# Altium project ESP32-Realy-Switch-var-1.PrjPCB
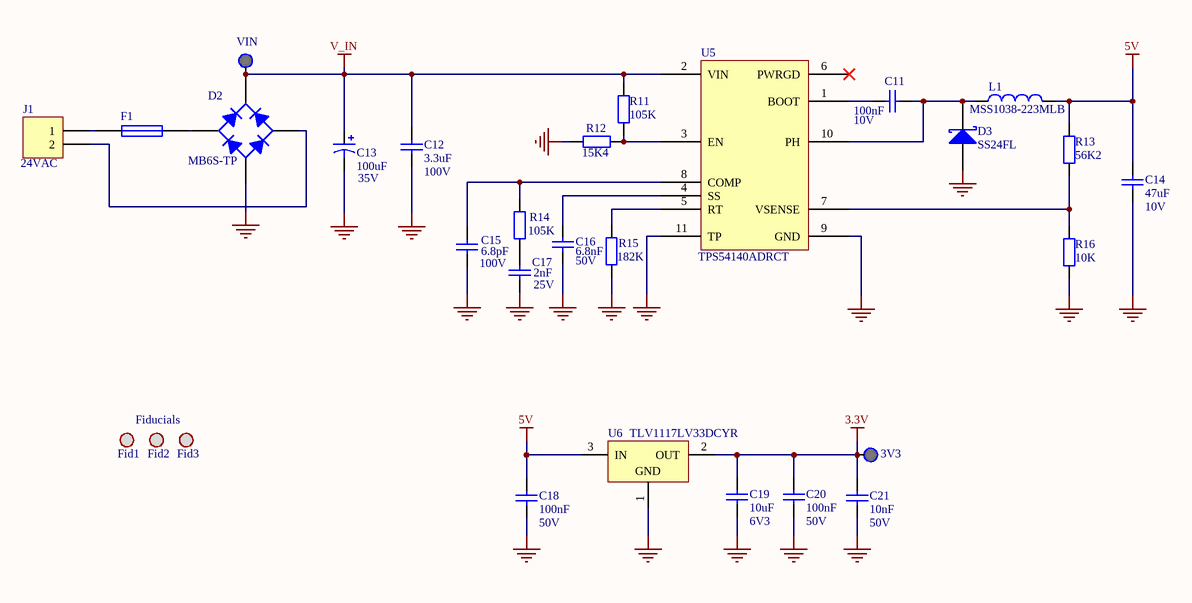
[diagram p0: Power Supply.SchDoc]
Engineer: M.GUENI; Title: CONNECTORS
5 sheets, 121 parts. Net scope: flat (ports and power ports of the same name join across sheets).
Board file: ESP32-Realy-Switch-var-1.PcbDoc
Sheets:
  Power Supply.SchDoc
  RF.SchDoc
  USB-PROG.SchDoc
  Relay.SchDoc
  CONNECTORS.SchDoc

## Sheet Power Supply.SchDoc: Power supply
size A4; Engineer: M.GUENI

### Parts
3V3  Test Point  [TP]  (value not drawn)  (no BOM)
C11  Value 1: 100nF  Value 2: 10V  [CAPC1608N]  (hidden comment: Capacitor)
C12  Value 1: 3.3uF  Value 2: 100V  [CAPC3216N]  (hidden comment: Capacitor)
C13  Value 1: 100uF  Value 2: 35V  [ECAP_SMD_6.3]  (hidden comment: Polarized Capacitor)
C14  Value 1: 47uF  Value 2: 10V  [CAPC2012N]  (hidden comment: Capacitor)
C15  Value 1: 6.8pF  Value 2: 100V  [CAPC1608N]  (hidden comment: Capacitor)
C16  Value 1: 6.8nF  Value 2: 50V  [CAPC1608N]  (hidden comment: Capacitor)
C17  Value 1: 2nF  Value 2: 25V  [CAPC2012N]  (hidden comment: Capacitor)
C18  Value 1: 100nF  Value 2: 50V  [CAPC1608N]  (hidden comment: Capacitor)
C19  Value 1: 10uF  Value 2: 6V3  [CAPC2012N]  (hidden comment: Capacitor)
C20  Value 1: 100nF  Value 2: 50V  [CAPC1608N]  (hidden comment: Capacitor)
C21  Value 1: 10nF  Value 2: 50V  [CAPC1608N]  (hidden comment: Capacitor)
D2  MB6S-TP  [MB6S]
D3  SS24FL  [SOD-123F]
F1  0452.500NRL  [Fuse_NANO2]  (value not drawn)
Fid1  Fiducial  [FIDUCIAL-1MM]  (value not drawn)
Fid2  Fiducial  [FIDUCIAL-1MM]  (value not drawn)
Fid3  Fiducial  [FIDUCIAL-1MM]  (value not drawn)
J1  24VAC  [CUI_TB007-508-02BE]
L1  MSS1038-223MLB  [MSS1038]
R11  Value 1: 105K  [RESC1608N]  (hidden comment: Resistor)
R12  Value 1: 15K4  [RESC1608N]  (hidden comment: Resistor)
R13  Value 1: 56K2  [RESC1608N]  (hidden comment: Resistor)
R14  Value 1: 105K  [RESC1608N]  (hidden comment: Resistor)
R15  Value 1: 182K  [RESC1608N]  (hidden comment: Resistor)
R16  Value 1: 10K  [RESC1608N]  (hidden comment: Resistor)
U5  TPS54140ADRCT  [VSON-10]
U6  TLV1117LV33DCYR  [SOT223]
VIN  Test Point  [TP]  (value not drawn)  (no BOM)

### Nets
3.3V: 3V3.1 C19.2 C20.2 C21.2 U6.2(OUT)
5V: C14.2 C18.2 L1.2 R13.2 U6.3(IN)
GND: C12.1 C13.2 C14.1 C15.1 C16.1 C17.1 C18.1 C19.1 C20.1 C21.1 D2.3(A) D3.1(A) R12.1 R15.1 R16.1 U5.9(GND) U5.11(TP) U6.1(GND)
V_IN: C12.2 C13.1 D2.1(K) R11.2 U5.2(VIN) VIN.1
NetC11_1: C11.1 U5.1(BOOT)
NetC11_2: C11.2 D3.2(K) L1.1 U5.10(PH)
NetC15_2: C15.2 R14.2 U5.8(COMP)
NetC16_2: C16.2 U5.4(SS)
NetC17_2: C17.2 R14.1
NetD2_2: D2.2(C) J1.2
NetD2_4: D2.4(C) F1.2
NetF1_1: F1.1 J1.1
NetR11_1: R11.1 R12.2 U5.3(EN)
NetR13_1: R13.1 R16.2 U5.7(VSENSE)
NetR15_2: R15.2 U5.5(RT)

Not connected (* = marked no-connect by the designer): U5 6(PWRGD)*

### Notes on the sheet
- Fiducials

### Library data of the parts
3V3 VIN = MIS-000000003: MAN: _; Part Number: MIS-000000003; MANREF: _; DES: _; Value 1: _; Value 2: _; TOL: _; FTP: _; SUP: _; SUPREF: _; NOTE: _
C11 = CAP-000000005: MAN: KEMET; MANREF: C0603X104K8RACTU; DES: C0603X104K8RACTU -  Condensateur céramique multicouche CMS, 0.1 µF, 10 V, 0603 [1608 Metric], ± 10%, X7R; TOL: 10%; FTP: 0603; SUP: Farnell; SUPREF: 2904937; NOTE: _; Part Number: CAP-000000005
C12 = CAP-000000009: MAN: TDK; MANREF: C3216X7S2A335M160AB; DES: C3216X7S2A335M160AB -  Condensateur céramique multicouche CMS, 3.3 µF, 100 V, 1206 [3216 Metric], ± 20%, X7S, C Series TDK; TOL: 20%; FTP: 1206; SUP: Farnell; SUPREF: 2526280; NOTE: _; Part Number: CAP-000000009
C13 = CAP-000000001: MAN: PANASONIC; MANREF: EEEFK1V101XP; DES: PANASONIC ELECTRONIC COMPONENTS  EEEFK1V101XP  CONDENSATEUR ELEC ALU 100UF 35V CMS; TOL: 20%; FTP: SMD Size D8; SUP: Farnell; SUPREF: 1850114; NOTE: _; Part Number: CAP-000000001
C14 = CAP-000000004: MAN: MURATA; MANREF: GRM21BR61A476ME15L; DES: GRM21BR61A476ME15L -  Condensateur céramique multicouche CMS, 47 µF, 10 V, 0805 [2012 Metric], ± 20%, X5R, GRM Series; TOL: 20%; FTP: 0805; SUP: Farnell; SUPREF: 2611939; NOTE: _; Part Number: CAP-000000004
C15 = CAP-000000008: MAN: AVX; MANREF: 06031U6R8BAT2A; DES: Multilayer Ceramic Capacitors MLCC - SMD/SMT 100V 6.8pF C0G 0603 .1pF Tol; TOL: _; FTP: 0603; SUP: Mouser; SUPREF: 581-06031U6R8BAT2A; Part Number: CAP-000000008; NOTE: _
C16 = CAP-000000006: MAN: KEMET; MANREF: C0603X682K5GECAUTO; DES: C0603X682K5GECAUTO -  Condensateur céramique multicouche CMS, ESD, AEC-Q200, 6800 pF, 50 V, 0603 [1608 Metric], ± 10%; TOL: 10%; FTP: 0603; SUP: Farnell; SUPREF: 2760504; NOTE: _; Part Number: CAP-000000006
C17 = CAP-000000007: MAN: KEMET; MANREF: C0805C202J3GACTU; DES: C0805C202J3GACTU -  Condensateur céramique multicouche CMS, 2000 pF, 25 V, 0805 [2012 Metric], ± 5%, C0G / NP0; TOL: 5%; FTP: 0805; SUP: Farnell; SUPREF: 2905236; NOTE: _; Part Number: CAP-000000007
C18 C20 = CAP-000000002: MAN: VISHAY; MANREF: VJ0603V104ZXAPW1BC; DES: VJ0603V104ZXAPW1BC -  Condensateur céramique multicouche CMS, 0.1 µF, 50 V, 0603 [1608 Metric], +80%, -20%, Y5V; TOL: +80% -20%; FTP: 0603; SUP: Farnell; SUPREF: 2896408; NOTE: _; Part Number: CAP-000000002
C19 = CAP-000000001: MAN: MULTICOMP; MANREF: MCTT21X106M6R3CT; DES: MCTT21X106M6R3CT -  Condensateur céramique multicouche CMS, 10 µF, 6.3 V, 0805 [2012 Metric], ± 20%, X5R, Série MCTT; TOL: 20%; FTP: 0805; SUP: Farnell; SUPREF: 1759476; NOTE: _; Part Number: CAP-000000001
C21 = CAP-000000003: MAN: MULTICOMP; MANREF: 06035C103JAT2A; DES: 06035C103JAT2A -  Condensateur céramique multicouche CMS, 10000 pF, 50 V, 0603 [1608 Metric], ± 5%, X7R; TOL: 5%; FTP: 0603; SUP: Farnell; SUPREF: 1833871; NOTE: _; Part Number: CAP-000000003
D2 = DIB-000000001: MAN: Micro Commercial Components (MCC); DES: Redresseurs en pont .5A 600V; Value 1: 0.5A; Value 2: 600V; TOL: _; FTP: MBS-1; SUP: Mouser; SUPREF: 833-MB6S-TP; Part Number: DIB-000000001; MANREF: MB6S-TP; NOTE: _
D3 = DIS-000000002: MAN: ON Semiconductor / Fairchild; DES: Schottky Diodes & Rectifiers 40V, 2A SCHOTTKY; Value 1: 2A; Value 2: 40V; TOL: _; FTP: SOD-123-2; SUP: Mouser; SUPREF: 512-SS24FL; Part Number: DIS-000000002; MANREF: SS24FL; NOTE: _
F1 = FUS-000000002: MAN: LITTELFUSE; DES: 0452.500NRL -  Fusible / Montage en surface, Série NANO2, 500 mA, 125 VAC, 32 VDC, Temporisé, CMS; Value 1: 500mA; Value 2: 32VDC; TOL: _; SUP: Farnell; SUPREF: 9922326; Part Number: FUS-000000002; MANREF: 0452.500NRL; FTP: _; NOTE: _
Fid1-Fid3 = MIS-000000004: MAN: _; Value 1: 1mm; Part Number: MIS-000000004; MANREF: _; DES: _; Value 2: _; TOL: _; FTP: _; SUP: _; SUPREF: _; NOTE: _
J1 = CON-000000001: MAN: CUI Devices; MANREF: TB007-508-02BE / 39910-0102; DES: Fixed Terminal Blocks Terminal block, screw type, 5.08 , horizontal, 2 poles, CUI Blue, slotted screw, PCB mount; Value 1: 2pts; Value 2: 5.08 mm; TOL: _; FTP: THT; SUP: Mouser; SUPREF: 490-TB007-508-02BE; Part Number: CON-000000001; NOTE: _
L1 = IND-000000001: MAN: Coilcraft; DES: Fixed Inductors MSS1038 SMT Shielded 22 uH 20 % 2.85 A; Value 1: 22uH; Value 2: 2.85A; TOL: 20%; FTP: _; SUP: Mouser; SUPREF: 994-MSS1038-223MLB; Part Number: IND-000000001; MANREF: MSS1038-223MLB; NOTE: _
R11 R14 = RES-000000003: MAN: PANASONIC ELECTRONIC COMPONENT; MANREF: ERJ3EKF1053V; DES: ERJ3EKF1053V -  Résistance à puce CMS, Couche épaisse, 105 kohm, Série ERJ3E, 75 V, Couche épaisse; Value 2: 0.1W; TOL: 1%; FTP: 0603; SUP: Farnell; SUPREF: 2059494; NOTE: _; Part Number: RES-000000003
R12 = RES-000000002: MAN: MULTICOMP; MANREF: MCMR06X1542FTL; DES: MCMR06X1542FTL -  Résistance à puce CMS, Céramique, 15.4 kohm, Série MCMR, 75 V, Couche épaisse, 0603 [1608 Metric]; Value 2: 0.1W; TOL: 1%; FTP: 0603; SUP: Farnell; SUPREF: 2073397; NOTE: _; Part Number: RES-000000002
R13 = RES-000000005: MAN: MULTICOMP; MANREF: MCWR06X5622FTL; DES: MCWR06X5622FTL -  Résistance à puce CMS, 56.2 kohm, MCWR06 Series, 75 V, Couche épaisse, 0603 [1608 Metric], 100 mW; Value 2: 0.1W; TOL: 1%; FTP: 0603; SUP: Farnell; SUPREF: 2694903; NOTE: _; Part Number: RES-000000005
R15 = RES-000000004: MAN: PANASONIC ELECTRONIC COMPONENTS; MANREF: ERJ3EKF1823V; DES: ERJ3EKF1823V -  Résistance à puce CMS, Couche épaisse, 182 kohm, Série ERJ3E, 75 V, Couche épaisse; Value 2: 0.1W; TOL: 1%; FTP: 0603; SUP: Farnell; SUPREF: 2059508; NOTE: _; Part Number: RES-000000004
R16 = RES-000000001: MAN: YAGEO; MANREF: RC0603FR-0710KL; DES: YAGEO (PHYCOMP)  RC0603FR-0710KL  RESISTANCE COUCHE EPAISSE 10K 0.1W 1%; Value 2: 0.1W; TOL: 1%; FTP: 0603; SUP: Farnell; SUPREF: 9238603; NOTE: _; Part Number: RES-000000001
U5 = ICP-000000006: MAN: Texas Instruments; DES: Switching Voltage Regulators 3.5-42Vin,1.5A SD Converter; Value 1: _; SUP: Mouser; SUPREF: 595-TPS54140ADRCT; Part Number: ICP-000000006; MANREF: TPS54140ADRCT; Value 2: _; TOL: _; FTP: VSON-10; NOTE: _
U6 = VRG-000000001: MAN: Texas Instrument; DES: TEXAS INSTRUMENTS  TLV1117LV33DCYR  LDO FIXE 3.3V 1A SOT-223-4; Value 1: 3.3V; Value 2: 1A; TOL: _; FTP: SOT-223; SUP: Mouser; SUPREF: 595-TLV1117LV33DCYR; Part Number: VRG-000000001; MANREF: TLV1117LV33DCYR; NOTE: _

## Sheet RF.SchDoc: RF
size A4; Engineer: M.GUENI; Revision: R0; SheetNumber: 2; SheetTotal: 5
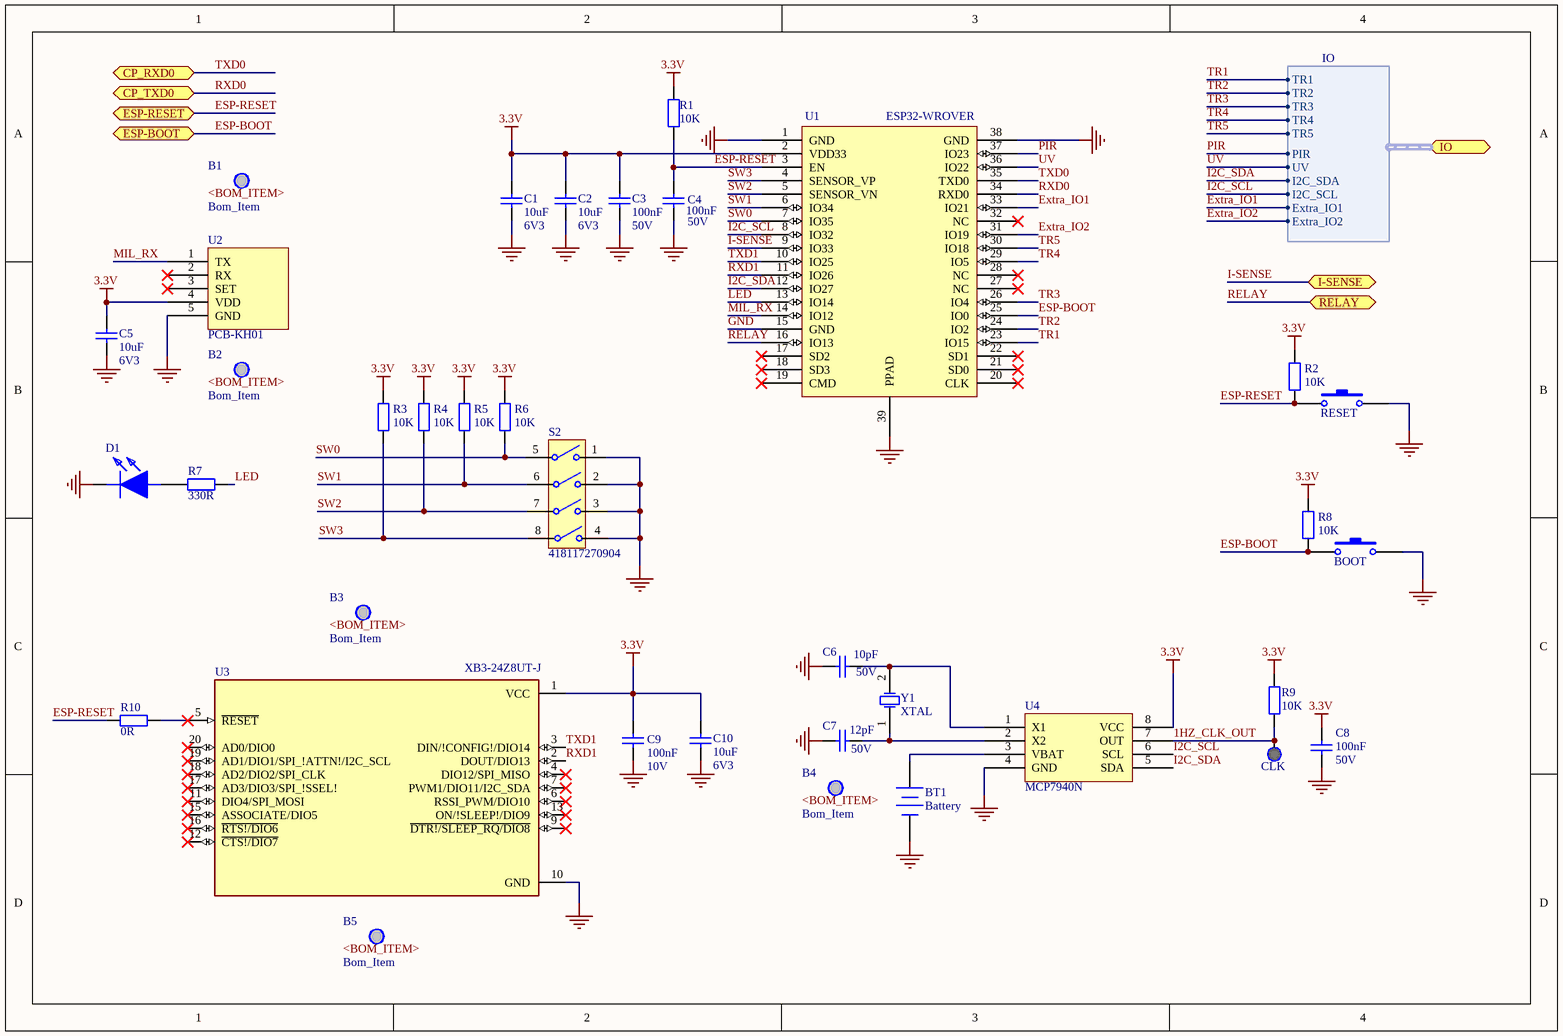
[diagram p1: RF.SchDoc]

### Parts
B1  Bom_Item  [_]  (mechanical)
B2  Bom_Item  [_]  (mechanical)
B3  Bom_Item  [_]  (mechanical)
B4  Bom_Item  [_]  (mechanical)
B5  Bom_Item  [_]  (mechanical)
BOOT  _  [FSM4]  (value not drawn)
BT1  Battery  [3050]
C1  Value 1: 10uF  Value 2: 6V3  [CAPC2012N]  (hidden comment: Capacitor)
C2  Value 1: 10uF  Value 2: 6V3  [CAPC2012N]  (hidden comment: Capacitor)
C3  Value 1: 100nF  Value 2: 50V  [CAPC1608N]  (hidden comment: Capacitor)
C4  Value 1: 100nF  Value 2: 50V  [CAPC1608N]  (hidden comment: Capacitor)
C5  Value 1: 10uF  Value 2: 6V3  [CAPC2012N]  (hidden comment: Capacitor)
C6  Value 1: 10pF  Value 2: 50V  [CAPC1608N]  (hidden comment: Capacitor)
C7  Value 1: 12pF  Value 2: 50V  [CAPC1608N]  (hidden comment: Capacitor)
C8  Value 1: 100nF  Value 2: 50V  [CAPC1608N]  (hidden comment: Capacitor)
C9  Value 1: 100nF  Value 2: 10V  [CAPC1608N]  (hidden comment: Capacitor)
C10  Value 1: 10uF  Value 2: 6V3  [CAPC2012N]  (hidden comment: Capacitor)
CLK  Test Point  [TP]  (value not drawn)  (no BOM)
D1  150080BS75000  [LEDC2012X80N1]  (value not drawn)
R1  Value 1: 10K  [RESC1608N]  (hidden comment: Resistor)
R2  Value 1: 10K  [RESC1608N]  (hidden comment: Resistor)
R3  Value 1: 10K  [RESC1608N]  (hidden comment: Resistor)
R4  Value 1: 10K  [RESC1608N]  (hidden comment: Resistor)
R5  Value 1: 10K  [RESC1608N]  (hidden comment: Resistor)
R6  Value 1: 10K  [RESC1608N]  (hidden comment: Resistor)
R7  Value 1: 330R  [RESC1608N]  (hidden comment: Resistor)
R8  Value 1: 10K  [RESC1608N]  (hidden comment: Resistor)
R9  Value 1: 10K  [RESC1608N]  (hidden comment: Resistor)
R10  Value 1: 0R  [RESC1608N]  (hidden comment: Resistor)
RESET  _  [FSM4]  (value not drawn)
S2  418117270904  [418117270904]
U1  ESP32-WROVER  [ESP32-WROVER]
U2  PCB-KH01  [MILIGHT_RF_MODULE]
U3  XB3-24Z8UT-J  [XB3-24Z8UT-J]
U4  MCP7940N  [DFN-8]
Y1  XTAL  [ECX-31B]

### Ports
CP_RXD0 (bidir), CP_TXD0 (bidir), ESP-BOOT (bidir), ESP-RESET (bidir), I-SENSE (bidir), IO (bidir, harness IO), RELAY (bidir)

### Harnesses
IO: TR1, TR2, TR3, TR4, TR5, PIR, UV, I2C_SDA, I2C_SCL, Extra_IO1, Extra_IO2

### Nets
3.3V: C1.1 C2.2 C3.2 C5.1 C8.2 C9.2 C10.2 R1.1 R2.2 R3.2 R4.2 R5.2 R6.2 R8.2 R9.2 U1.2(VDD33) U2.4(VDD) U3.1(VCC) U4.8(VCC)
GND: BOOT.2 BT1.2(-) C1.2 C2.1 C3.1 C4.1 C5.2 C6.1 C7.1 C8.1 C9.1 C10.1 D1.1(K) RESET.2 S2.1 S2.2 S2.3 S2.4 U1.1(GND) U1.15(GND) U1.38(GND) U1.39(PPAD) U2.5(GND) U3.10(GND) U4.4(GND)
1HZ_CLK_OUT: CLK.1 R9.1 U4.7(OUT)
ESP-BOOT: BOOT.1 R8.1 U1.25(IO0) ; port ESP-BOOT
ESP-RESET: C4.2 R1.2 R2.1 R10.2 RESET.1 U1.3(EN) ; port ESP-RESET
Extra_IO1: U1.33(IO21) ; port IO.Extra_IO1
Extra_IO2: U1.31(IO19) ; port IO.Extra_IO2
I2C_SCL: U1.8(IO32) U4.6(SCL) ; port IO.I2C_SCL
I2C_SDA: U1.12(IO27) U4.5(SDA) ; port IO.I2C_SDA
I-SENSE: U1.9(IO33) ; port I-SENSE
LED: R7.1 U1.13(IO14)
MIL_RX: U1.14(IO12) U2.1(TX)
PIR: U1.37(IO23) ; port IO.PIR
RELAY: U1.16(IO13) ; port RELAY
RXD0: U1.34(RXD0) ; port CP_TXD0
RXD1: U1.11(IO26) U3.2(DOUT/DIO13)
SW0: R6.1 S2.5 U1.7(IO35)
SW1: R5.1 S2.6 U1.6(IO34)
SW2: R4.1 S2.7 U1.5(SENSOR_VN)
SW3: R3.1 S2.8 U1.4(SENSOR_VP)
TR1: U1.23(IO15) ; port IO.TR1
TR2: U1.24(IO2) ; port IO.TR2
TR3: U1.26(IO4) ; port IO.TR3
TR4: U1.29(IO5) ; port IO.TR4
TR5: U1.30(IO18) ; port IO.TR5
TXD0: U1.35(TXD0) ; port CP_RXD0
TXD1: U1.10(IO25) U3.3(DIN/!CONFIG!/DIO14)
UV: U1.36(IO22) ; port IO.UV
NetBT1_1: BT1.1(+) U4.3(VBAT)
NetC6_2: C6.2 U4.1(X1) Y1.2(OSC2)
NetC7_2: C7.2 U4.2(X2) Y1.1(OSC1)
NetD1_2: D1.2(A) R7.2
NetR10_1: R10.1 U3.5(~{RESET})

Not connected (* = marked no-connect by the designer): U1 17(SD2)* 18(SD3)* 19(CMD)* 20(CLK)* 21(SD0)* 22(SD1)* 27(NC)* 28(NC)* 32(NC)*; U2 2(RX)* 3(SET)*; U3 4(DIO12/SPI_MISO)* 6(RSSI_PWM/DIO10)* 7(PWM1/DIO11/I2C_SDA)* 9(~{DTR!/SLEEP_RQ/DIO8})* 11(DIO4/SPI_MOSI)* 12(~{CTS!/DIO7})* 13(ON/!SLEEP!/DIO9)* 15(ASSOCIATE/DIO5)* 16(~{RTS!/DIO6})* 17(AD3/DIO3/SPI_!SSEL!)* 18(AD2/DIO2/SPI_CLK)* 19(AD1/DIO1/SPI_!ATTN!/I2C_SCL)* 20(AD0/DIO0)*

### Notes on the sheet
- Title:
- Micro Device Tunisie
- Size:
- Date:
- File:
- A4
- Engineer :
- Revision:
- Sheet
- of
- Cyber Parc  Hammam Sousse
- Avenue Charles De Gaulle
- 4011, Hammam-Sousse, Tunisie
- contact@mdtunisie.com
- (in symbol MIS-000000001) <BOM_ITEM>
- (in symbol MIS-000000019) <BOM_ITEM>
- (in symbol MIS-000000023) <BOM_ITEM>

### Library data of the parts
B1 B2 = MIS-000000019: MAN: TE CONNECTIVITY; MANREF: 215298-5; DES: Embase PCB, Carte-à-carte, 2.54 mm, 1 Rangée(s), 5 Contact(s), Montage traversant, AMPMODU Series; Value 1: 2.54 mm; SUP: Farnell; SUPREF: 2971171; Part Number: MIS-000000019; Value 2: _; TOL: _; FTP: _; NOTE: _
B3 B5 = MIS-000000001: MAN: TE CONNECTIVITY / Ajouter au comparateur / L'image a des fins d'illustration uniquement. Veuillez lire la description du produit. / TE CONNECTIVITY / Fabricant :; MANREF: 1-2314878-0; DES: 1-2314878-0 -  Connecteur carte-à-carte, 2 mm, 10 Contact(s), Embase, AMPMODU Series, Traversant, 1 Rangée(s); Value 1: 2mm; Value 2: 10pts; SUP: Farnell; SUPREF: 3289695; Part Number: MIS-000000001; TOL: _; FTP: _; NOTE: _
B4 = MIS-000000023: MAN: RENATA; MANREF: CR1025; DES: Batterie, Pile bouton, Cellule simple, 3 V, 1025, Lithium-dioxide de manganèse, 30 mAh; Value 1: 3V; Value 2: 30mAh; SUP: Farnell; SUPREF: 4199066; Part Number: MIS-000000023; TOL: _; FTP: _; NOTE: _
BOOT RESET = MIS-000000020: Part Number: MIS-000000020; MAN: _; MANREF: _; DES: _; Value 1: _; Value 2: _; TOL: _; FTP: _; SUP: _; SUPREF: _; NOTE: _
BT1 = MIS-000000022: Multicell Battery; MAN: Keystone Electronics; DES: Contacts de piles 10MM SM COIN CELL CLIP; Value 1: _; SUP: Mouser; SUPREF: 534-3050; Part Number: MIS-000000022; MANREF: 3050; Value 2: _; TOL: _; FTP: _; NOTE: _
C1 C2 C5 C10 = CAP-000000001: as C19 on sheet Power Supply; Part Number: CAP-000000001
C3 C4 C8 = CAP-000000002: as C18 on sheet Power Supply; Part Number: CAP-000000002
C6 = CAP-000000014: MAN: MULTICOMP; MANREF: MC0603N100J500CT; DES: MULTICOMP  MC0603N100J500CT  CONDENSATEUR MLCC C0G/NP0 10PF 50V 0603; TOL: 5%; FTP: 0603; SUP: Farnell; SUPREF: 2320799; NOTE: _; Part Number: CAP-000000014
C7 = CAP-000000015: MAN: MULTICOMP; MANREF: MC0603N120J500CT; DES: MULTICOMP 	MC0603N120J500CT  Condensateur céramique multicouche CMS, Série MC, 12 pF, ± 5%, C0G / NP0, 50 V, 0603 [1608 Metric]; TOL: 5%; FTP: 0603; SUP: Farnell; SUPREF: 1759054; NOTE: _; Part Number: CAP-000000015
C9 = CAP-000000005: as C11 on sheet Power Supply; Part Number: CAP-000000005
CLK = MIS-000000003: MAN: _; Part Number: MIS-000000003; MANREF: _; DES: _; Value 1: _; Value 2: _; TOL: _; FTP: _; SUP: _; SUPREF: _; NOTE: _
D1 = LED-000000002: MAN: Wurth Elektronik; DES: Standard LEDs - SMD WL-SMCW SMDMono TpVw Waterclr 0805 Blue; Value 1: 20 mA; Value 2: _; SUP: Mouser; SUPREF: 710-150080BS75000; Part Number: LED-000000002; MANREF: 150080BS75000; TOL: _; FTP: _; NOTE: _
R1-R6 R8 R9 = RES-000000001: as R16 on sheet Power Supply; Part Number: RES-000000001
R7 = RES-000000080: MAN: MULTICOMP; MANREF: MCMR06X331 JTL; DES: MCMR06X331 JTL -  Résistance à puce CMS, Céramique, 330 ohm, Série MCMR, 75 V, Couche épaisse, 0603 [1608 Metric]; Value 2: 0.1W; TOL: 1%; FTP: 0603; SUP: Farnell; SUPREF: 2073475; NOTE: _; Part Number: RES-000000080
R10 = RES-000000103: MAN: Vishay / Beyschlag; MANREF: MCT06030Z0000ZP500; DES: Thin Film Resistors - SMD Zero ohm Jumper; Value 2: 0.125W; TOL: _; FTP: 0603; SUP: Mouser; SUPREF: 594-MCT06030Z0000ZP5; Part Number: RES-000000103; NOTE: _
S2 = SWC-000000004: MAN: Wurth Elektronik; DES: Commutateurs DIL/Commutateurs SIL WS-DITV DIP 4p THT 2.54mm Hrztl Box; Value 1: _; SUP: Mouser; SUPREF: 710-418117270904; NOTE: In Stock; Part Number: SWC-000000004; MANREF: 418117270904; Value 2: _; TOL: _; FTP: _
U1 = RFC-000000001: MAN: Espressif Systems; DES: Modules WiFi / 802.11 SMD Module, ESP32-D0WDQ6, 32Mbits PSRAM, 32Mbits SPI flash, PCB Antenna; Value 1: _; SUP: ASTONE TECHNOLOGY; Part Number: RFC-000000001; MANREF: ESP32-WROVER; Value 2: _; TOL: _; FTP: _; SUPREF: ESP32-WROVER; NOTE: _
U2 = RFC-000000003: MAN: Milight; DES: RF Module; Value 1: _; SUP: Deliled; Part Number: RFC-000000003; MANREF: PCB-KH01; Value 2: _; TOL: _; FTP: _; SUPREF: PCB-KH01; NOTE: _
U3 = RFC-000000002: MAN: DIGI; DES: Zigbee Modules (802.15.4) XBee3,2.4 Ghz ZB 3.0, U.FL Ant, TH MT; Value 1: _; SUP: Mouser; SUPREF: 888-XB3-24Z8UT; Part Number: RFC-000000002; MANREF: XB3-24Z8UT-J; Value 2: _; TOL: _; FTP: _; NOTE: _
U4 = GIC-000000001: 64 x 8, Serial, I2C Real-Time Clock; MAN: Microchip Technology; MANREF: MCP7940NT-I/MNY; DES: Horloge en temps réel I2C GP RTCC 64B SRAM; Value 1: _; SUP: Mouser; SUPREF: 579-MCP7940NT-I/MNY; Part Number: GIC-000000001; Value 2: _; TOL: _; FTP: DFN-8; NOTE: _
Y1 = MIS-000000021: Crystal Oscillator; MAN: ECS; MANREF: ECS-.327-6-34B-TR; DES: Quartz 32.768kHz 6pF 20ppm -40C +85C; Value 1: 32.768KHZ; Value 2: 6pF; TOL: _; SUP: Mouser; SUPREF: 520-.327-6-34BT; Part Number: MIS-000000021; FTP: _; NOTE: _

## Sheet USB-PROG.SchDoc: USB-PROGRAMMER
size A4; Engineer: M.GUENI; Revision: R0; SheetNumber: 3; SheetTotal: 5
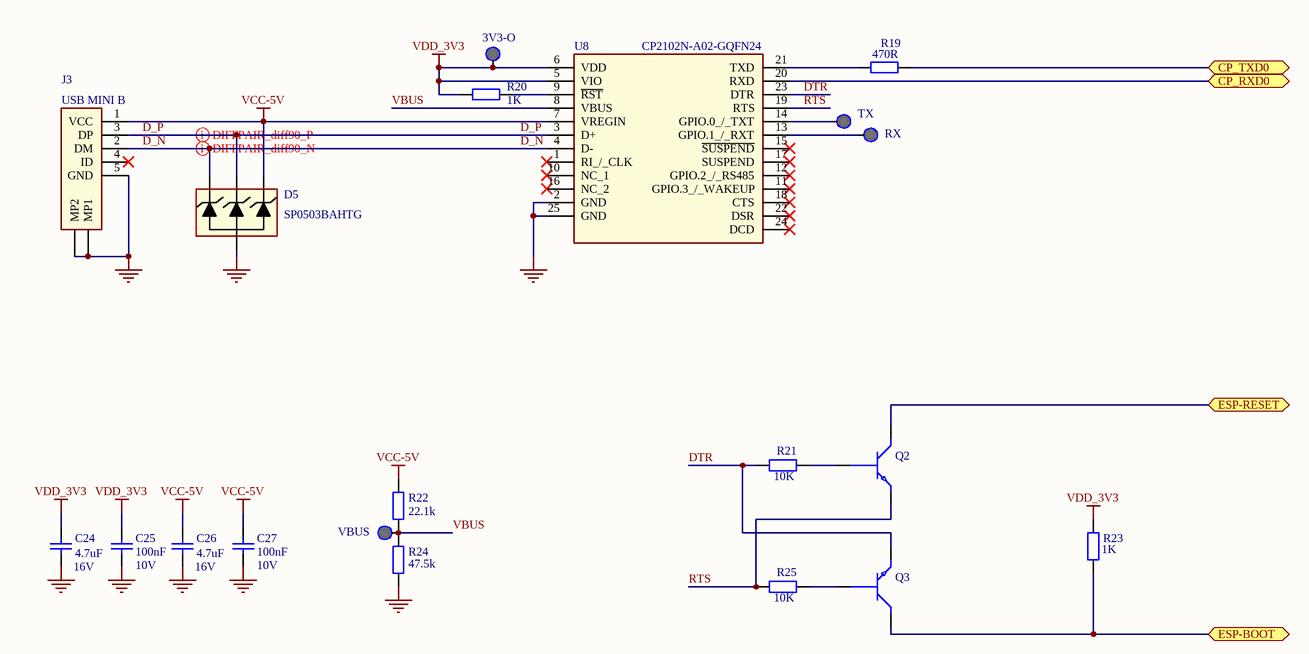
[diagram p2: USB-PROG.SchDoc]

### Parts
3V3-O  Test Point  [TP]  (value not drawn)  (no BOM)
C24  Value 1: 4.7uF  Value 2: 16V  [CAPC1608N]  (hidden comment: Capacitor)
C25  Value 1: 100nF  Value 2: 10V  [CAPC1608N]  (hidden comment: Capacitor)
C26  Value 1: 4.7uF  Value 2: 16V  [CAPC1608N]  (hidden comment: Capacitor)
C27  Value 1: 100nF  Value 2: 10V  [CAPC1608N]  (hidden comment: Capacitor)
D5  SP0503BAHTG  [SOT192P237X122-4N]
J3  USB MINI B  [502237-0517]
Q2  MMSS8050-H-TP  [SOT95P245X112-3N]  (value not drawn)
Q3  MMSS8050-H-TP  [SOT95P245X112-3N]  (value not drawn)
R19  Value 1: 470R  [RESC1608N]  (hidden comment: Resistor)
R20  Value 1: 1K  [RESC1608N]  (hidden comment: Resistor)
R21  Value 1: 10K  [RESC1608N]  (hidden comment: Resistor)
R22  Value 1: 22.1k  [RESC1608N]  (hidden comment: Resistor)
R23  Value 1: 1K  [RESC1608N]  (hidden comment: Resistor)
R24  Value 1: 47.5k  [RESC1608N]  (hidden comment: Resistor)
R25  Value 1: 10K  [RESC1608N]  (hidden comment: Resistor)
RX  Test Point  [TP]  (value not drawn)  (no BOM)
TX  Test Point  [TP]  (value not drawn)  (no BOM)
U8  CP2102N-A02-GQFN24  [QFN50P400X400X80-25N-D]
VBUS  Test Point  [TP]  (value not drawn)  (no BOM)

### Ports
CP_RXD0 (bidir), CP_TXD0 (bidir), ESP-BOOT (bidir), ESP-RESET (bidir)

### Nets
GND: C24.1 C25.1 C26.1 C27.1 D5.1 J3.5(GND) J3.MP1 J3.MP2 R24.1 U8.2(GND) U8.25(GND)
VCC-5V: C26.2 C27.2 D5.4 J3.1(VCC) R22.2 U8.7(VREGIN)
VDD_3V3: 3V3-O.1 C24.2 C25.2 R20.1 R23.2 U8.5(VIO) U8.6(VDD)
D_N: D5.2 J3.2(DM) U8.4(D-)
D_P: D5.3 J3.3(DP) U8.3(D+)
DTR: Q3.2(E) R21.1 U8.23(DTR)
ESP-BOOT: Q3.3(C) R23.1 ; port ESP-BOOT
ESP-RESET: Q2.3(C) ; port ESP-RESET
RTS: Q2.2(E) R25.1 U8.19(RTS)
RXD0: R19.2 ; port CP_TXD0
TXD0: U8.20(RXD) ; port CP_RXD0
VBUS: R22.1 R24.2 U8.8(VBUS) VBUS.1
NetQ2_1: Q2.1(B) R21.2
NetQ3_1: Q3.1(B) R25.2
NetR19_1: R19.1 U8.21(TXD)
NetR20_2: R20.2 U8.9(~{RST})
NetRX_1: RX.1 U8.13(GPIO.1_/_RXT)
NetTX_1: TX.1 U8.14(GPIO.0_/_TXT)

Not connected (* = marked no-connect by the designer): J3 4(ID)*; U8 1(RI_/_CLK)* 10(NC_1)* 11(GPIO.3_/_WAKEUP)* 12(GPIO.2_/_RS485)* 15(~{SUSPEND})* 16(NC_2)* 17(SUSPEND)* 18(CTS)* 22(DSR)* 24(DCD)*

### Layout directives
differential pair; differential pair class Diff90: D_N, D_P

### Notes on the sheet
- Title:
- Micro Device Tunisie
- Size:
- Date:
- File:
- A4
- Engineer :
- Revision:
- Sheet
- of
- Cyber Parc  Hammam Sousse
- Avenue Charles De Gaulle
- 4011, Hammam-Sousse, Tunisie
- contact@mdtunisie.com

### Library data of the parts
3V3-O RX TX VBUS = MIS-000000003: MAN: _; Part Number: MIS-000000003; MANREF: _; DES: _; Value 1: _; Value 2: _; TOL: _; FTP: _; SUP: _; SUPREF: _; NOTE: _
C24 C26 = CAP-000000047: MAN: Murata Electronics; MANREF: GRM188C71C475KE21D; DES: Multilayer Ceramic Capacitors MLCC - SMD/SMT 4.7UF 16V 10% 0603; TOL: 10%; FTP: 0603; SUP: Mouser; SUPREF: 81-GRM188C71C475KE1D; NOTE: _; Part Number: CAP-000000047
C25 C27 = CAP-000000005: as C11 on sheet Power Supply; Part Number: CAP-000000005
D5 = TVS-000000002: MAN: Littelfuse; DES: ESD Suppressors / TVS Diodes TVS AVAL DIODE SMT; Value 1: 5.5 V; Value 2: 30 pF; TOL: _; FTP: SOT-143; SUP: Mouser; SUPREF: 576-SP0503BAHTG; Part Number: TVS-000000002; MANREF: SP0503BAHTG; NOTE: _
J3 = CON-000000005: MAN: Molex; DES: USB Connectors USB Mini-B Rec Hsg Assy S/T 5Ckt; Value 1: _; FTP: THT; SUP: Mouser; SUPREF: 538-502237-0517; Part Number: CON-000000005; MANREF: 502237-0517; Value 2: _; TOL: _; NOTE: _
Q2 Q3 = TRP-000000003: MAN: Micro Commercial Components (MCC); DES: Bipolar Transistors - BJT 625mW, 25V, 1500mA; Value 1: 1.5 A; Value 2: 5 V; SUP: Mouser; SUPREF: 833-MMSS8050-H-TP; NOTE: _; Part Number: TRP-000000003; MANREF: MMSS8050-H-TP
R19 = RES-000000016: MAN: YAGEO; MANREF: RC0603FR-10470RL; DES: Thick Film Resistors - SMD 470 OHM 1%; Value 2: 0.1W; TOL: 1%; FTP: 0603; SUP: Mouser; SUPREF: 603-RC0603FR-10470RL; NOTE: _; Part Number: RES-000000016
R20 R23 = RES-000000006: MAN: TE Connectivity / Neohm; MANREF: CPF0603F1K0C1; DES: Thin Film Resistors - SMD 1KOhm .063W 50PPM; Value 2: 0.625W; TOL: 1%; FTP: 0603; SUP: Mouser; SUPREF: 279-CPF0603F1K0C1; NOTE: _; Part Number: RES-000000006
R21 R25 = RES-000000001: as R16 on sheet Power Supply; Part Number: RES-000000001
R22 = RES-000000017: MAN: Panasonic; MANREF: ERA-3AED2212V; DES: Thin Film Resistors - SMD 0603 22.1Kohms 25ppm 0.5% AEC-Q200; Value 2: 0.1W; TOL: 0.5%; FTP: 0603; SUP: Mouser; SUPREF: 667-ERA-3AED2212V; NOTE: _; Part Number: RES-000000017
R24 = RES-000000018: MAN: Vishay / Dale; MANREF: CRCW060347K5FKEA; DES: Thick Film Resistors - SMD 1/10watt 47.5Kohms 1%; Value 2: 0.1W; TOL: 1%; FTP: 0603; SUP: Mouser; SUPREF: 71-CRCW0603-47.5K-E3; NOTE: _; Part Number: RES-000000018
U8 = MIS-000000025: MAN: SILICON LABS; DES: Circuit intégré d'interface USB USBXpress - USB to UART Bridge QFN24; Value 1: _; FTP: QFN-24; SUP: Mouser; SUPREF: 634-CP2102NA02GQFN24; Part Number: MIS-000000025; MANREF: CP2102N-A02-GQFN24; Value 2: _; TOL: _; NOTE: _

## Sheet Relay.SchDoc: CONNECTORS
size A4
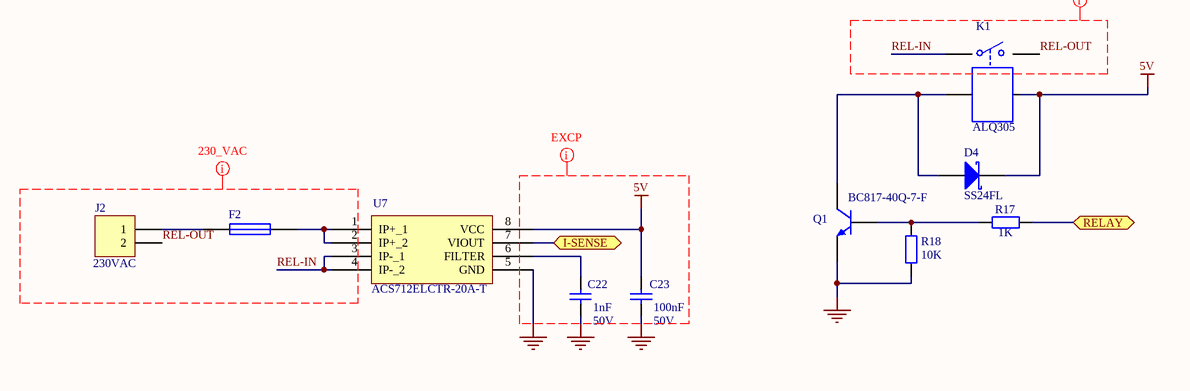
[diagram p3: Relay.SchDoc]

### Parts
C22  Value 1: 1nF  Value 2: 50V  [CAPC1608N]  (hidden comment: Capacitor)
C23  Value 1: 100nF  Value 2: 50V  [CAPC1608N]  (hidden comment: Capacitor)
D4  SS24FL  [SOD-123F]
F2  0031.8001  [SCHURTER_0031.8201]  (value not drawn)
J2  230VAC  [CUI_TB007-508-02BE]
K1  ALQ305  [ALQ305]
Q1  BC817-40Q-7-F  [SOT23-3N]
R17  Value 1: 1K  [RESC1608N]  (hidden comment: Resistor)
R18  Value 1: 10K  [RESC1608N]  (hidden comment: Resistor)
U7  ACS712ELCTR-20A-T  [SOIC127P600X175-8N]

### Ports
I-SENSE (bidir), RELAY (bidir)

### Nets
5V: C23.2 D4.2(K) K1.1(COIL_1) U7.8(VCC)
GND: C22.1 C23.1 Q1.3(E) R18.1 U7.5(GND)
I-SENSE: U7.7(VIOUT) ; port I-SENSE
REL-IN: K1.3(COM) U7.3(IP-_1) U7.4(IP-_2)
REL-OUT: J2.2 K1.2(NO)
RELAY: R17.2 ; port RELAY
NetC22_2: C22.2 U7.6(FILTER)
NetD4_1: D4.1(A) K1.4(COIL_2) Q1.2(C)
NetF2_1: F2.1 J2.1
NetF2_2: F2.2 U7.1(IP+_1) U7.2(IP+_2)
NetQ1_1: Q1.1(B) R17.1 R18.2

### Layout directives
net class 230_VAC: REL-IN, REL-OUT
net class EXCP: 5V, GND

### Library data of the parts
C22 = CAP-000000010: MAN: MULTICOMP; MANREF: MC0603B102K500CT; DES: MC0603B102K500CT -  Condensateur céramique multicouche CMS, 0603 [1608 Metric], 1000 pF, 50 V, ± 10%, X7R, Série MC; TOL: 10%; FTP: 0603; SUP: Farnell; SUPREF: 1759088; NOTE: _; Part Number: CAP-000000010
C23 = CAP-000000002: as C18 on sheet Power Supply; Part Number: CAP-000000002
D4 = DIS-000000002: as D3 on sheet Power Supply; Part Number: DIS-000000002; MANREF: SS24FL; NOTE: _
F2 = FUS-000000001: MAN: Schurter; DES: Fuse Holder OG FUSEHOLDER 5X20; Value 1: 10A; Value 2: 600V; TOL: _; SUP: Mouser; SUPREF: 693-0031.8001; Part Number: FUS-000000001; MANREF: 0031.8001; FTP: _; NOTE: _
J2 = CON-000000001: as J1 on sheet Power Supply; Part Number: CON-000000001; NOTE: _
K1 = SWC-000000003: MAN: Panasonic Industrial Devices; DES: General Purpose Relays LQ Relay; Value 1: 10 A; Value 2: 5 VDC; SUP: Mouser; SUPREF: 769-ALQ305; NOTE: _; Part Number: SWC-000000003; MANREF: ALQ305
Q1 = TRP-000000001: MAN: Diodes Incorporated; DES: Bipolar Transistors - BJT SS Low Sat Transistor; Value 1: 0.5A; Value 2: 45V; TOL: _; FTP: SOT-23; SUP: Mouser; SUPREF: 621-BC817-40Q-7-F; Part Number: TRP-000000001; MANREF: BC817-40Q-7-F; NOTE: _
R17 = RES-000000006: as R20 on sheet USB-PROG; Part Number: RES-000000006
R18 = RES-000000001: as R16 on sheet Power Supply; Part Number: RES-000000001
U7 = SEN-000000001: MAN: ALLEGRO MICROSYSTEMS; DES: ACS712ELCTR-20A-T -  Capteur de courant linéaire, Effet Hall, +/- 20A, SOIC-8; Value 1: 20A; Value 2: 5V; TOL: _; FTP: SOIC-8; SUP: Farnell; SUPREF: 1329624RL; Part Number: SEN-000000001; MANREF: ACS712ELCTR-20A-T; NOTE: _

## Sheet CONNECTORS.SchDoc: CONNECTORS
size A4; Engineer: M.GUENI; Revision: R0; SheetNumber: 5; SheetTotal: 5
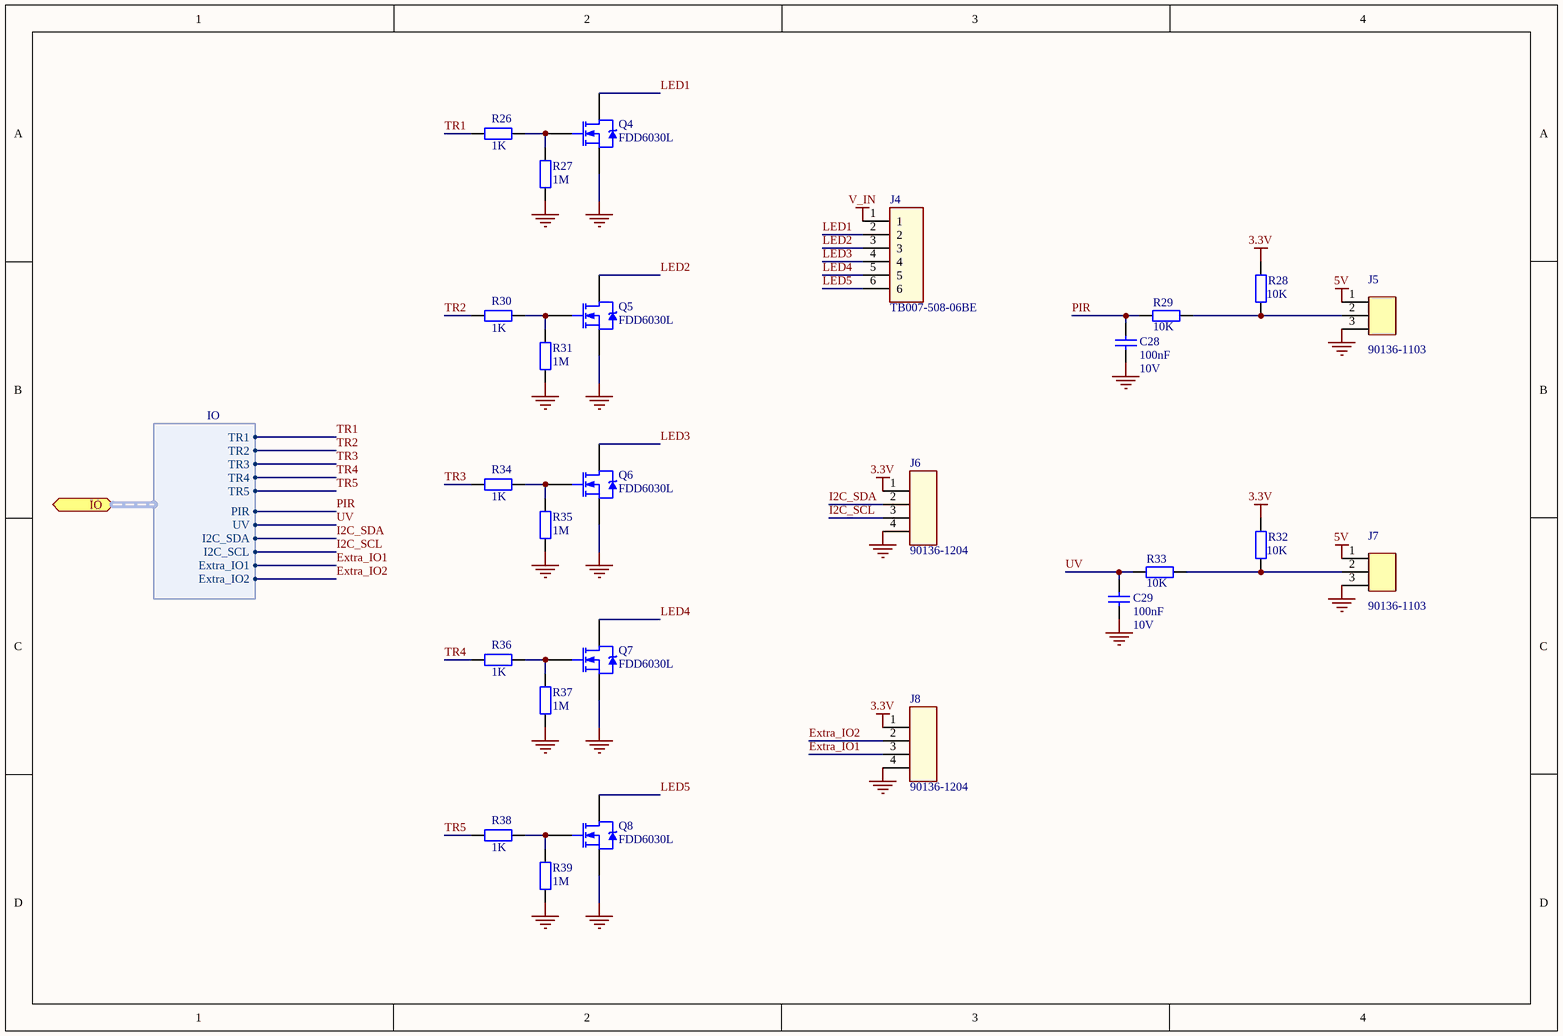
[diagram p4: CONNECTORS.SchDoc]

### Parts
C28  Value 1: 100nF  Value 2: 10V  [CAPC1608N]  (hidden comment: Capacitor)
C29  Value 1: 100nF  Value 2: 10V  [CAPC1608N]  (hidden comment: Capacitor)
J4  TB007-508-06BE  [HDR1X6]
J5  90136-1103  [HDR1X3]
J6  90136-1204  [HDR1X4]
J7  90136-1103  [HDR1X3]
J8  90136-1204  [HDR1X4]
Q4  FDD6030L  [TO-252-3]
Q5  FDD6030L  [TO-252-3]
Q6  FDD6030L  [TO-252-3]
Q7  FDD6030L  [TO-252-3]
Q8  FDD6030L  [TO-252-3]
R26  Value 1: 1K  [RESC1608N]  (hidden comment: Resistor)
R27  Value 1: 1M  [RESC1608N]  (hidden comment: Resistor)
R28  Value 1: 10K  [RESC1608N]  (hidden comment: Resistor)
R29  Value 1: 10K  [RESC1608N]  (hidden comment: Resistor)
R30  Value 1: 1K  [RESC1608N]  (hidden comment: Resistor)
R31  Value 1: 1M  [RESC1608N]  (hidden comment: Resistor)
R32  Value 1: 10K  [RESC1608N]  (hidden comment: Resistor)
R33  Value 1: 10K  [RESC1608N]  (hidden comment: Resistor)
R34  Value 1: 1K  [RESC1608N]  (hidden comment: Resistor)
R35  Value 1: 1M  [RESC1608N]  (hidden comment: Resistor)
R36  Value 1: 1K  [RESC1608N]  (hidden comment: Resistor)
R37  Value 1: 1M  [RESC1608N]  (hidden comment: Resistor)
R38  Value 1: 1K  [RESC1608N]  (hidden comment: Resistor)
R39  Value 1: 1M  [RESC1608N]  (hidden comment: Resistor)

### Ports
IO (bidir, harness IO)

### Harnesses
IO: TR1, TR2, TR3, TR4, TR5, PIR, UV, I2C_SDA, I2C_SCL, Extra_IO1, Extra_IO2

### Nets
3.3V: J6.1 J8.1 R28.2 R32.2
5V: J5.1 J7.1
GND: C28.1 C29.1 J5.3 J6.4 J7.3 J8.4 Q4.3(S) Q5.3(S) Q6.3(S) Q7.3(S) Q8.3(S) R27.1 R31.1 R35.1 R37.1 R39.1
V_IN: J4.1
Extra_IO1: J8.3 ; port IO.Extra_IO1
Extra_IO2: J8.2 ; port IO.Extra_IO2
I2C_SCL: J6.3 ; port IO.I2C_SCL
I2C_SDA: J6.2 ; port IO.I2C_SDA
LED1: J4.2 Q4.4(D)
LED2: J4.3 Q5.4(D)
LED3: J4.4 Q6.4(D)
LED4: J4.5 Q7.4(D)
LED5: J4.6 Q8.4(D)
PIR: C28.2 R29.2 ; port IO.PIR
TR1: R26.1 ; port IO.TR1
TR2: R30.1 ; port IO.TR2
TR3: R34.1 ; port IO.TR3
TR4: R36.1 ; port IO.TR4
TR5: R38.1 ; port IO.TR5
UV: C29.2 R33.2 ; port IO.UV
NetJ5_2: J5.2 R28.1 R29.1
NetJ7_2: J7.2 R32.1 R33.1
NetQ4_1: Q4.1(G) R26.2 R27.2
NetQ5_1: Q5.1(G) R30.2 R31.2
NetQ6_1: Q6.1(G) R34.2 R35.2
NetQ7_1: Q7.1(G) R36.2 R37.2
NetQ8_1: Q8.1(G) R38.2 R39.2

### Notes on the sheet
- Title:
- Micro Device Tunisie
- Size:
- Date:
- File:
- A4
- Engineer :
- Revision:
- Sheet
- of
- Cyber Parc  Hammam Sousse
- Avenue Charles De Gaulle
- 4011, Hammam-Sousse, Tunisie
- contact@mdtunisie.com

### Library data of the parts
C28 C29 = CAP-000000005: as C11 on sheet Power Supply; Part Number: CAP-000000005
J4 = CON-000000007: MAN: CUI Devices; DES: Borniers fixes Terminal block, screw type, 5.08 , horizontal, 6 poles, CUI Blue, slotted screw, PCB mount; Value 1: 6pts; Value 2: _; FTP: THT; SUP: Mouser; SUPREF: 490-TB007-508-06BE; Part Number: CON-000000007; MANREF: TB007-508-06BE; TOL: _; NOTE: _
J5 J7 = CON-000000003: MAN: Molex; DES: Headers & Wire Housings 2.54MM CGRIDIII HDR 3P V SR SHRD TIN; Value 1: 3pts; Value 2: 2,54 mm; TOL: _; FTP: THT; SUP: Mouser; SUPREF: 538-90136-1103; Part Number: CON-000000003; MANREF: 90136-1103; NOTE: _
J6 J8 = CON-000000004: MAN: Molex; DES: Headers & Wire Housings 2.54MM CGRIDIII HDR 4P V SR SHRD AU-E; Value 1: 4pts; Value 2: 2,54 mm; TOL: _; FTP: THT; SUP: Mouser; SUPREF: 538-90136-1204; Part Number: CON-000000004; MANREF: 90136-1204; NOTE: _
Q4-Q8 = TRM-000000001: MAN: ON Semiconductor / Fairchild; DES: MOSFET 30V N-Channel Power Trench; Value 1: 50 A; Value 2: 30 V; TOL: _; SUP: Mouser; SUPREF: 512-FDD6030L; Part Number: TRM-000000001; MANREF: FDD6030L; FTP: TO-252-3; NOTE: _
R26 R30 R34 R36 R38 = RES-000000006: as R20 on sheet USB-PROG; Part Number: RES-000000006
R27 R31 R35 R37 R39 = RES-000000010: MAN: WELWYN; MANREF: ASC0603-1M0FT5; DES: ASC0603-1M0FT5 -  Résistance à puce CMS, Couche épaisse, 1 Mohm, 50 V, Couche épaisse, 0603 [1608 Metric], 100 mW; Value 2: 0.1W; TOL: 1%; FTP: 0603; SUP: Farnell; SUPREF: 2078928; NOTE: _; Part Number: RES-000000010
R28 R29 R32 R33 = RES-000000001: as R16 on sheet Power Supply; Part Number: RES-000000001

## Nets that join several sheets
3.3V: Power Supply (5 pins), RF (19 pins), CONNECTORS (J6.1 J8.1 R28.2 R32.2)
5V: Power Supply (5 pins), Relay (C23.2 D4.2 K1.1 U7.8), CONNECTORS (J5.1 J7.1)
GND: Power Supply (18 pins), RF (25 pins), USB-PROG (11 pins), Relay (5 pins), CONNECTORS (16 pins)
V_IN: Power Supply (6 pins), CONNECTORS (J4.1)
ESP-BOOT: RF (BOOT.1 R8.1 U1.25), USB-PROG (Q3.3 R23.1)
ESP-RESET: RF (6 pins), USB-PROG (Q2.3)
Extra_IO1: RF (U1.33), CONNECTORS (J8.3)
Extra_IO2: RF (U1.31), CONNECTORS (J8.2)
I2C_SCL: RF (U1.8 U4.6), CONNECTORS (J6.3)
I2C_SDA: RF (U1.12 U4.5), CONNECTORS (J6.2)
I-SENSE: RF (U1.9), Relay (U7.7)
PIR: RF (U1.37), CONNECTORS (C28.2 R29.2)
RELAY: RF (U1.16), Relay (R17.2)
RXD0: RF (U1.34), USB-PROG (R19.2)
TR1: RF (U1.23), CONNECTORS (R26.1)
TR2: RF (U1.24), CONNECTORS (R30.1)
TR3: RF (U1.26), CONNECTORS (R34.1)
TR4: RF (U1.29), CONNECTORS (R36.1)
TR5: RF (U1.30), CONNECTORS (R38.1)
TXD0: RF (U1.35), USB-PROG (U8.20)
UV: RF (U1.36), CONNECTORS (C29.2 R33.2)

## Assembly variants
Variant of WIFI_RM_R0: not fitted R29